# Altium schematic sheet Array.SchDoc
size A; SheetNumber: 1; SheetTotal: 1
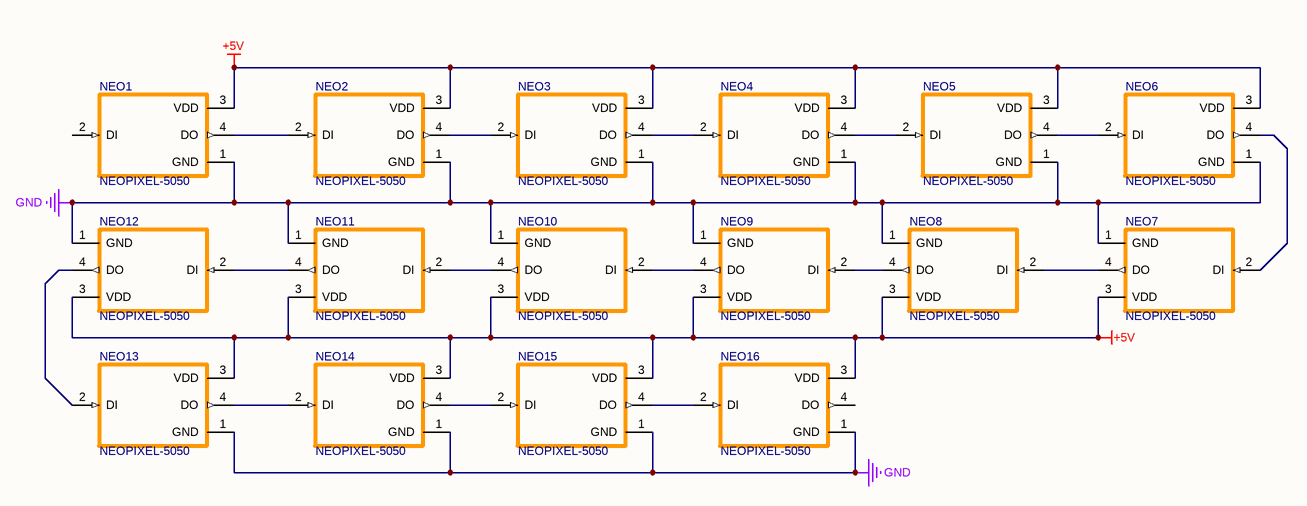
[diagram p0: Array.SchDoc]

## Parts
NEO1  NEOPIXEL-5050  [NEOPIXEL-5050]
NEO2  NEOPIXEL-5050  [NEOPIXEL-5050]
NEO3  NEOPIXEL-5050  [NEOPIXEL-5050]
NEO4  NEOPIXEL-5050  [NEOPIXEL-5050]
NEO5  NEOPIXEL-5050  [NEOPIXEL-5050]
NEO6  NEOPIXEL-5050  [NEOPIXEL-5050]
NEO7  NEOPIXEL-5050  [NEOPIXEL-5050]
NEO8  NEOPIXEL-5050  [NEOPIXEL-5050]
NEO9  NEOPIXEL-5050  [NEOPIXEL-5050]
NEO10  NEOPIXEL-5050  [NEOPIXEL-5050]
NEO11  NEOPIXEL-5050  [NEOPIXEL-5050]
NEO12  NEOPIXEL-5050  [NEOPIXEL-5050]
NEO13  NEOPIXEL-5050  [NEOPIXEL-5050]
NEO14  NEOPIXEL-5050  [NEOPIXEL-5050]
NEO15  NEOPIXEL-5050  [NEOPIXEL-5050]
NEO16  NEOPIXEL-5050  [NEOPIXEL-5050]

## Nets
+5V: NEO1.3(VDD) NEO2.3(VDD) NEO3.3(VDD) NEO4.3(VDD) NEO5.3(VDD) NEO6.3(VDD) NEO7.3(VDD) NEO8.3(VDD) NEO9.3(VDD) NEO10.3(VDD) NEO11.3(VDD) NEO12.3(VDD) NEO13.3(VDD) NEO14.3(VDD) NEO15.3(VDD) NEO16.3(VDD)
GND: NEO1.1(GND) NEO2.1(GND) NEO3.1(GND) NEO4.1(GND) NEO5.1(GND) NEO6.1(GND) NEO7.1(GND) NEO8.1(GND) NEO9.1(GND) NEO10.1(GND) NEO11.1(GND) NEO12.1(GND) NEO13.1(GND) NEO14.1(GND) NEO15.1(GND) NEO16.1(GND)
NetNEO1_4: NEO1.4(DO) NEO2.2(DI)
NetNEO2_4: NEO2.4(DO) NEO3.2(DI)
NetNEO3_4: NEO3.4(DO) NEO4.2(DI)
NetNEO4_4: NEO4.4(DO) NEO5.2(DI)
NetNEO5_4: NEO5.4(DO) NEO6.2(DI)
NetNEO6_4: NEO6.4(DO) NEO7.2(DI)
NetNEO7_4: NEO7.4(DO) NEO8.2(DI)
NetNEO8_4: NEO8.4(DO) NEO9.2(DI)
NetNEO9_4: NEO9.4(DO) NEO10.2(DI)
NetNEO10_4: NEO10.4(DO) NEO11.2(DI)
NetNEO11_4: NEO11.4(DO) NEO12.2(DI)
NetNEO12_4: NEO12.4(DO) NEO13.2(DI)
NetNEO13_4: NEO13.4(DO) NEO14.2(DI)
NetNEO14_4: NEO14.4(DO) NEO15.2(DI)
NetNEO15_4: NEO15.4(DO) NEO16.2(DI)

Not connected (* = marked no-connect by the designer): NEO1 2(DI); NEO16 4(DO)